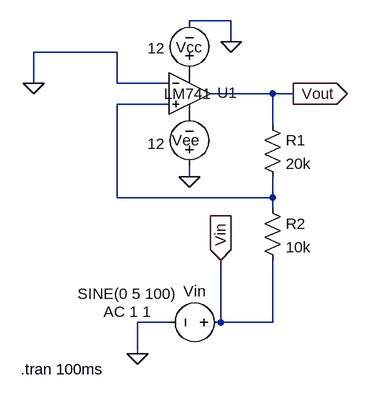
[diagram p0: schematic partC.asc]
partC.asc, the LTspice schematic file:
Version 4
SHEET 1 880 680
WIRE 240 96 176 96
WIRE 240 128 240 96
WIRE 64 144 -64 144
WIRE -64 192 -64 144
WIRE 64 192 64 144
WIRE 144 192 64 192
WIRE 304 208 208 208
WIRE 336 208 304 208
WIRE 144 224 64 224
WIRE 304 256 304 208
WIRE 176 336 176 320
WIRE 64 368 64 224
WIRE 304 368 304 336
WIRE 304 368 64 368
WIRE 304 384 304 368
WIRE 144 560 96 560
WIRE 224 560 224 464
WIRE 304 560 304 464
WIRE 304 560 224 560
WIRE 96 608 96 560
FLAG 96 608 0
FLAG 240 128 0
FLAG 176 336 0
FLAG 336 208 Vout
IOPIN 336 208 Out
FLAG 224 464 Vin
IOPIN 224 464 In
FLAG -64 192 0
SYMBOL LM741 176 144 R0
WINDOW 0 43 63 Left 2
WINDOW 3 -39 64 Left 2
SYMATTR InstName U1
SYMBOL voltage 240 560 R90
WINDOW 0 -32 56 VBottom 2
WINDOW 3 -60 160 VTop 2
WINDOW 123 -32 160 VTop 2
WINDOW 39 0 0 Left 0
SYMATTR InstName Vin
SYMATTR Value SINE(0 5 100)
SYMATTR Value2 AC 1 1
SYMBOL voltage 176 192 R180
WINDOW 0 -19 55 Left 2
WINDOW 3 38 54 Left 2
WINDOW 123 0 0 Left 0
WINDOW 39 0 0 Left 0
SYMATTR InstName Vcc
SYMATTR Value 12
SYMBOL voltage 176 336 R180
WINDOW 0 -16 56 Left 2
WINDOW 3 38 51 Left 2
WINDOW 123 0 0 Left 0
WINDOW 39 0 0 Left 0
SYMATTR InstName Vee
SYMATTR Value 12
SYMBOL res 288 240 R0
SYMATTR InstName R1
SYMATTR Value 20k
SYMBOL res 288 368 R0
SYMATTR InstName R2
SYMATTR Value 10k
TEXT -84 632 Left 2 !.tran 100ms

The netlist it stands for:
* partC.asc
XU1 N001 0 P001 P002 Vout LM741  ; pins In+ In- V+ V- OUT
Vin Vin 0 SINE(0 5 100) AC 1 1
Vcc P001 0 12
Vee 0 P002 12
R1 Vout N001 20k
R2 N001 Vin 10k
.tran 100ms
.lib LM741.lib
.backanno
.end